# EAGLE design DIMM (EAGLE 5.10)
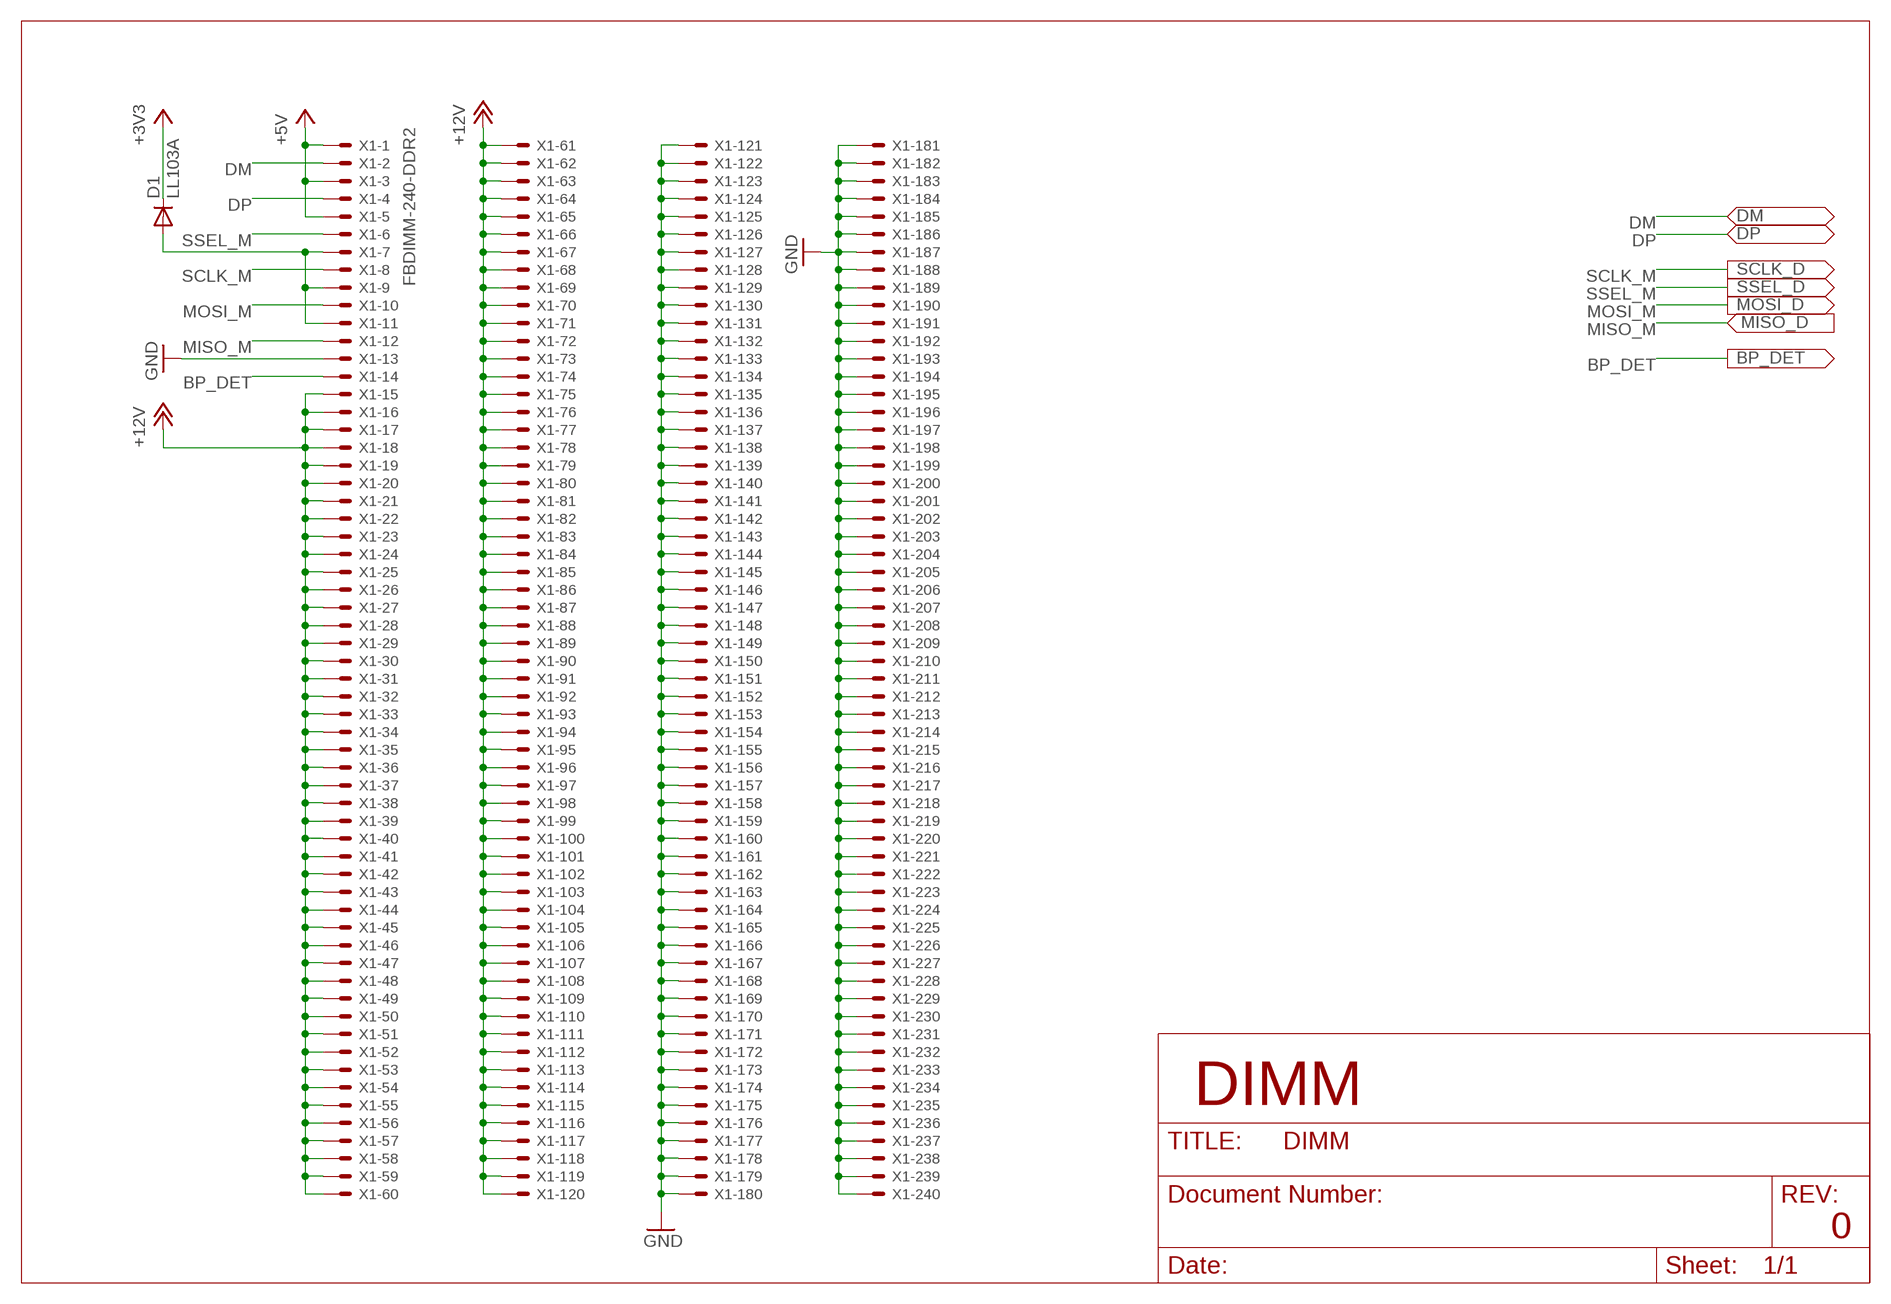
[diagram p0: schematic, sheet 1]

## Parts
D1  LL103A  DIODE-MINIMELF  [MINIMELF]
X1  FBDIMM-240-DDR2  [FBDIMM-240-DDR2]

## Nets
+3V3: D1.C
+5V: X1.1 X1.3 X1.5
+12V: X1.15 X1.16 X1.17 X1.18 X1.19 X1.20 X1.21 X1.22 X1.23 X1.24 X1.25 X1.26 X1.27 X1.28 X1.29 X1.30 X1.31 X1.32 X1.33 X1.34 X1.35 X1.36 X1.37 X1.38 X1.39 X1.40 X1.41 X1.42 X1.43 X1.44 X1.45 X1.46 X1.47 X1.48 X1.49 X1.50 X1.51 X1.52 X1.53 X1.54 X1.55 X1.56 X1.57 X1.58 X1.59 X1.60 X1.61 X1.62 X1.63 X1.64 X1.65 X1.66 X1.67 X1.68 X1.69 X1.70 X1.71 X1.72 X1.73 X1.74 X1.75 X1.76 X1.77 X1.78 X1.79 X1.80 X1.81 X1.82 X1.83 X1.84 X1.85 X1.86 X1.87 X1.88 X1.89 X1.90 X1.91 X1.92 X1.93 X1.94 X1.95 X1.96 X1.97 X1.98 X1.99 X1.100 X1.101 X1.102 X1.103 X1.104 X1.105 X1.106 X1.107 X1.108 X1.109 X1.110 X1.111 X1.112 X1.113 X1.114 X1.115 X1.116 X1.117 X1.118 X1.119 X1.120
BP_DET: X1.14
DM: X1.2
DP: X1.4
GND: X1.13 X1.121 X1.122 X1.123 X1.124 X1.125 X1.126 X1.127 X1.128 X1.129 X1.130 X1.131 X1.132 X1.133 X1.134 X1.135 X1.136 X1.137 X1.138 X1.139 X1.140 X1.141 X1.142 X1.143 X1.144 X1.145 X1.146 X1.147 X1.148 X1.149 X1.150 X1.151 X1.152 X1.153 X1.154 X1.155 X1.156 X1.157 X1.158 X1.159 X1.160 X1.161 X1.162 X1.163 X1.164 X1.165 X1.166 X1.167 X1.168 X1.169 X1.170 X1.171 X1.172 X1.173 X1.174 X1.175 X1.176 X1.177 X1.178 X1.179 X1.180 X1.181 X1.182 X1.183 X1.184 X1.185 X1.186 X1.187 X1.188 X1.189 X1.190 X1.191 X1.192 X1.193 X1.194 X1.195 X1.196 X1.197 X1.198 X1.199 X1.200 X1.201 X1.202 X1.203 X1.204 X1.205 X1.206 X1.207 X1.208 X1.209 X1.210 X1.211 X1.212 X1.213 X1.214 X1.215 X1.216 X1.217 X1.218 X1.219 X1.220 X1.221 X1.222 X1.223 X1.224 X1.225 X1.226 X1.227 X1.228 X1.229 X1.230 X1.231 X1.232 X1.233 X1.234 X1.235 X1.236 X1.237 X1.238 X1.239 X1.240
MISO_M: X1.12
MOSI_M: X1.10
N$1: D1.A X1.7 X1.9 X1.11
SCLK_M: X1.8
SSEL_M: X1.6

## Notes on the sheet
- DIMM
- 0

## Library data of the parts
D1 = diode:DIODE-: DIODE
X1 = project:FBDIMM-240-DDR2: 240-Pin DDR2 SDRAM FBDIMM (MO-256 R/C B), open top

## Board
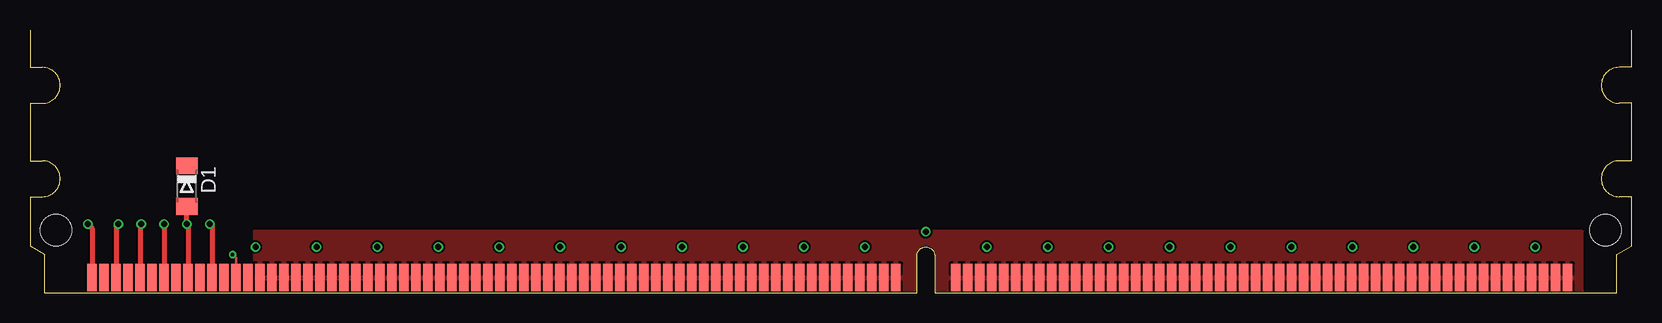
[diagram p1: board, top side]
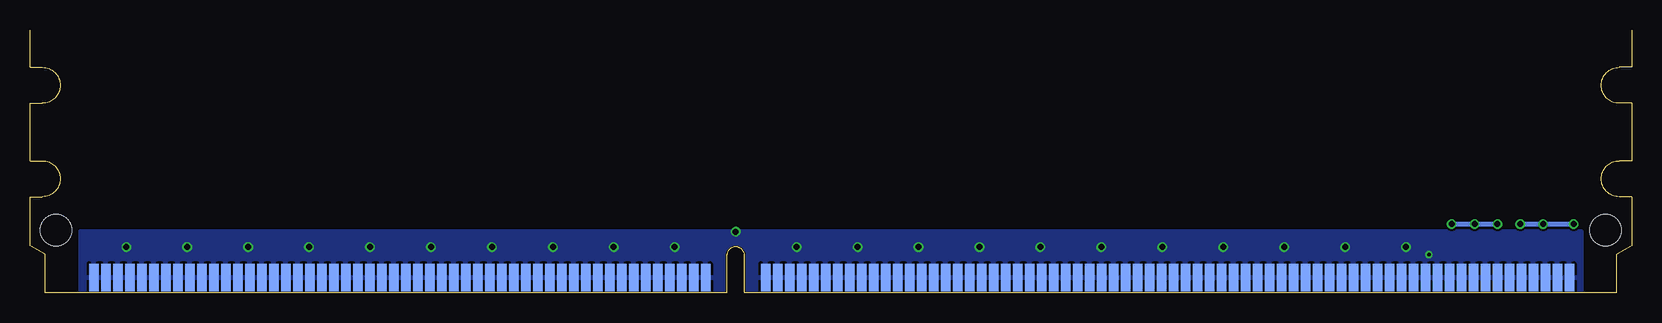
[diagram p2: board, bottom side, seen from below]

Size 133.5 x 21.92 mm. Coordinates in mm from the lower left corner, seen from the top.
Copper layers (1+2*15+16): Top 0.035mm / dielectric 0.1mm / $GND 0.035mm / dielectric 0.86mm / Route15 0.035mm / dielectric 0.1mm / Bottom 0.035mm
Design rules "pcbcart": minimum track width 0.15mm, minimum drill 0.3mm, track to track 0.15mm, track to pad 0.15mm, pad to pad 0.15mm, via to via 0.15mm, smd to smd 0.15mm, copper to edge 0.1mm, drill to drill 0.2mm, minimum pad ring 0.2mm, minimum via ring 0.15mm, stop-mask expansion 0.075mm, vias tented up to drill 0mil, thermal gap 0.2mm

### Footprints (pad centres in the part's own frame; a part is rotated, then mirrored left to right if it is on the bottom)
MINIMELF = smd 1.4 x 1.8: A 1.7,0; C -1.7,0
FBDIMM-240-DDR2 = smd 0.8 x 2.3: 1 -69.5,1.25; 2 -68.5,1.25; 3 -67.5,1.25; 4 -66.5,1.25; 5 -65.5,1.25; 6 -64.5,1.25; 7 -63.5,1.25; 8 -62.5,1.25; 9 -61.5,1.25; 10 -60.5,1.25; 11 -59.5,1.25; 12 -58.5,1.25; 13 -57.5,1.25; 14 -56.5,1.25; 15 -55.5,1.25; 16 -54.5,1.25; 17 -53.5,1.25; 18 -52.5,1.25; 19 -51.5,1.25; 20 -50.5,1.25; 21 -49.5,1.25; 22 -48.5,1.25; 23 -47.5,1.25; 24 -46.5,1.25; 25 -45.5,1.25; 26 -44.5,1.25; 27 -43.5,1.25; 28 -42.5,1.25; 29 -41.5,1.25; 30 -40.5,1.25; 31 -39.5,1.25; 32 -38.5,1.25; 33 -37.5,1.25; 34 -36.5,1.25; 35 -35.5,1.25; 36 -34.5,1.25; 37 -33.5,1.25; 38 -32.5,1.25; 39 -31.5,1.25; 40 -30.5,1.25; 41 -29.5,1.25; 42 -28.5,1.25; 43 -27.5,1.25; 44 -26.5,1.25; 45 -25.5,1.25; 46 -24.5,1.25; 47 -23.5,1.25; 48 -22.5,1.25; 49 -21.5,1.25; 50 -20.5,1.25; 51 -19.5,1.25; 52 -18.5,1.25; 53 -17.5,1.25; 54 -16.5,1.25; 55 -15.5,1.25; 56 -14.5,1.25; 57 -13.5,1.25; 58 -12.5,1.25; 59 -11.5,1.25; 60 -10.5,1.25; 61 -9.5,1.25; 62 -8.5,1.25; 63 -7.5,1.25; 64 -6.5,1.25; 65 -5.5,1.25; 66 -4.5,1.25; 67 -3.5,1.25; 68 -2.5,1.25; 69 2.5,1.25; 70 3.5,1.25; 71 4.5,1.25; 72 5.5,1.25; 73 6.5,1.25; 74 7.5,1.25; 75 8.5,1.25; 76 9.5,1.25; 77 10.5,1.25; 78 11.5,1.25; 79 12.5,1.25; 80 13.5,1.25; 81 14.5,1.25; 82 15.5,1.25; 83 16.5,1.25; 84 17.5,1.25; 85 18.5,1.25; 86 19.5,1.25; 87 20.5,1.25; 88 21.5,1.25; 89 22.5,1.25; 90 23.5,1.25; 91 24.5,1.25; 92 25.5,1.25; 93 26.5,1.25; 94 27.5,1.25; 95 28.5,1.25; 96 29.5,1.25; 97 30.5,1.25; 98 31.5,1.25; 99 32.5,1.25; 100 33.5,1.25; 101 34.5,1.25; 102 35.5,1.25; 103 36.5,1.25; 104 37.5,1.25; 105 38.5,1.25; 106 39.5,1.25; 107 40.5,1.25; 108 41.5,1.25; 109 42.5,1.25; 110 43.5,1.25; 111 44.5,1.25; 112 45.5,1.25; 113 46.5,1.25; 114 47.5,1.25; 115 48.5,1.25; 116 49.5,1.25; 117 50.5,1.25; 118 51.5,1.25; 119 52.5,1.25; 120 53.5,1.25 | smd 0.8 x 2.3 bottom: 121 -69.5,1.25; 122 -68.5,1.25; 123 -67.5,1.25; 124 -66.5,1.25; 125 -65.5,1.25; 126 -64.5,1.25; 127 -63.5,1.25; 128 -62.5,1.25; 129 -61.5,1.25; 130 -60.5,1.25; 131 -59.5,1.25; 132 -58.5,1.25; 133 -57.5,1.25; 134 -56.5,1.25; 135 -55.5,1.25; 136 -54.5,1.25; 137 -53.5,1.25; 138 -52.5,1.25; 139 -51.5,1.25; 140 -50.5,1.25; 141 -49.5,1.25; 142 -48.5,1.25; 143 -47.5,1.25; 144 -46.5,1.25; 145 -45.5,1.25; 146 -44.5,1.25; 147 -43.5,1.25; 148 -42.5,1.25; 149 -41.5,1.25; 150 -40.5,1.25; 151 -39.5,1.25; 152 -38.5,1.25; 153 -37.5,1.25; 154 -36.5,1.25; 155 -35.5,1.25; 156 -34.5,1.25; 157 -33.5,1.25; 158 -32.5,1.25; 159 -31.5,1.25; 160 -30.5,1.25; 161 -29.5,1.25; 162 -28.5,1.25; 163 -27.5,1.25; 164 -26.5,1.25; 165 -25.5,1.25; 166 -24.5,1.25; 167 -23.5,1.25; 168 -22.5,1.25; 169 -21.5,1.25; 170 -20.5,1.25; 171 -19.5,1.25; 172 -18.5,1.25; 173 -17.5,1.25; 174 -16.5,1.25; 175 -15.5,1.25; 176 -14.5,1.25; 177 -13.5,1.25; 178 -12.5,1.25; 179 -11.5,1.25; 180 -10.5,1.25; 181 -9.5,1.25; 182 -8.5,1.25; 183 -7.5,1.25; 184 -6.5,1.25; 185 -5.5,1.25; 186 -4.5,1.25; 187 -3.5,1.25; 188 -2.5,1.25; 189 2.5,1.25; 190 3.5,1.25; 191 4.5,1.25; 192 5.5,1.25; 193 6.5,1.25; 194 7.5,1.25; 195 8.5,1.25; 196 9.5,1.25; 197 10.5,1.25; 198 11.5,1.25; 199 12.5,1.25; 200 13.5,1.25; 201 14.5,1.25; 202 15.5,1.25; 203 16.5,1.25; 204 17.5,1.25; 205 18.5,1.25; 206 19.5,1.25; 207 20.5,1.25; 208 21.5,1.25; 209 22.5,1.25; 210 23.5,1.25; 211 24.5,1.25; 212 25.5,1.25; 213 26.5,1.25; 214 27.5,1.25; 215 28.5,1.25; 216 29.5,1.25; 217 30.5,1.25; 218 31.5,1.25; 219 32.5,1.25; 220 33.5,1.25; 221 34.5,1.25; 222 35.5,1.25; 223 36.5,1.25; 224 37.5,1.25; 225 38.5,1.25; 226 39.5,1.25; 227 40.5,1.25; 228 41.5,1.25; 229 42.5,1.25; 230 43.5,1.25; 231 44.5,1.25; 232 45.5,1.25; 233 46.5,1.25; 234 47.5,1.25; 235 48.5,1.25; 236 49.5,1.25; 237 50.5,1.25; 238 51.5,1.25; 239 52.5,1.25; 240 53.5,1.25 | hole 2.6: -72.495,5.2; 56.645,5.2

### Placement (x,y rotation side)
D1  13.08,8.89 270 top
X1  74.67,0 0 top

### Tracks (layer width: path | path; a pad name or v marks a point on that pad's centre or on a via)
+5V  (via drill 0.5)
  Top 0.4: X1.1 5.17,5.37 v4.83,5.71 | v7.36,5.71 7.17,5.53 X1.3 | X1.5 9.17,5.62 v9.27,5.71
  Bottom 0.4: v4.83,5.71 v7.36,5.71 v9.27,5.71
+12V
  pour Top: 18.79,5.08 129.28,5.08 129.28,0 18.79,0
GND  (via drill 0.3, 0.5)
  Top 0.2: X1.13 17.17,2.89 v16.89,3.17
  other vias: 18.79,3.81 23.88,3.81 28.95,3.81 34.03,3.81 39.11,3.81 44.19,3.81 49.27,3.81 54.35,3.81 59.43,3.81 64.52,3.81 69.59,3.81 74.67,5.08 79.75,3.81 84.83,3.81 89.91,3.81 95,3.81 100.07,3.81 105.16,3.81 110.23,3.81 115.31,3.81 120.39,3.81 125.47,3.81
  pour Bottom: 4.19,5.08 129.28,5.08 129.28,0 4.19,0
N$1  (via drill 0.5)
  Top 0.4: v11.17,5.71 X1.7 | X1.9 13.17,5.62 v13.08,5.71 D1.A | X1.11 15.17,5.53 v14.98,5.71
  Bottom 0.4: v11.17,5.71 v13.08,5.71 v14.98,5.71